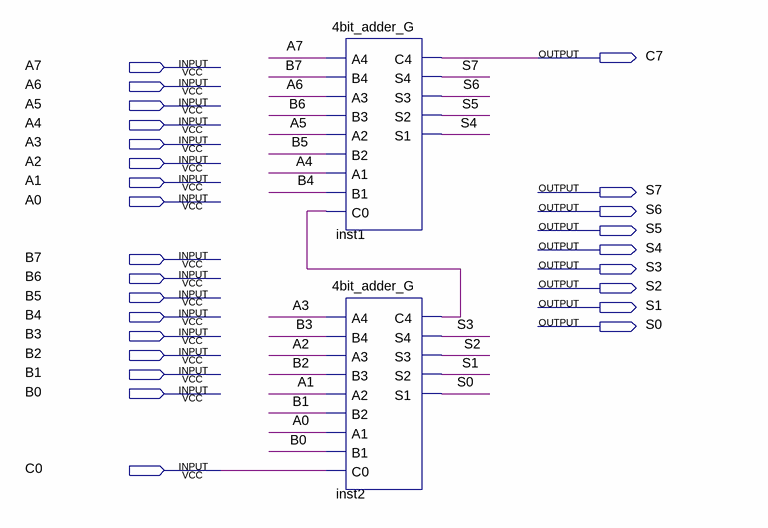
[diagram p0: schematic sheet]
// Quartus schematic 8bit_adder_G.bdf as structural Verilog: 2 symbols, 26 pins
module \8bit_adder_G  (
  input  A7,
  input  A6,
  input  A5,
  input  A4,
  input  A3,
  input  A2,
  input  A1,
  input  A0,
  input  B7,
  input  B6,
  input  B5,
  input  B4,
  input  B3,
  input  B2,
  input  B1,
  input  B0,
  input  C0,
  output C7,
  output S7,
  output S6,
  output S5,
  output S4,
  output S3,
  output S2,
  output S1,
  output S0
);

  wire inst2_c4;

  \4bit_adder_G  inst1 (
    .A4(A7), .B4(B7), .A3(A6), .B3(B6), .A2(A5), .B2(B5), .A1(A4), .B1(B4), .C0(inst2_c4), .C4(C7), .S4(S7),
    .S3(S6), .S2(S5), .S1(S4));
  \4bit_adder_G  inst2 (
    .A4(A3), .B4(B3), .A3(A2), .B3(B2), .A2(A1), .B2(B1), .A1(A0), .B1(B0), .C0(C0), .C4(inst2_c4), .S4(S3),
    .S3(S2), .S2(S1), .S1(S0));
endmodule
